# Altium schematic sheet SR.SchDoc
size A4; SheetNumber: 6; SheetTotal: 7
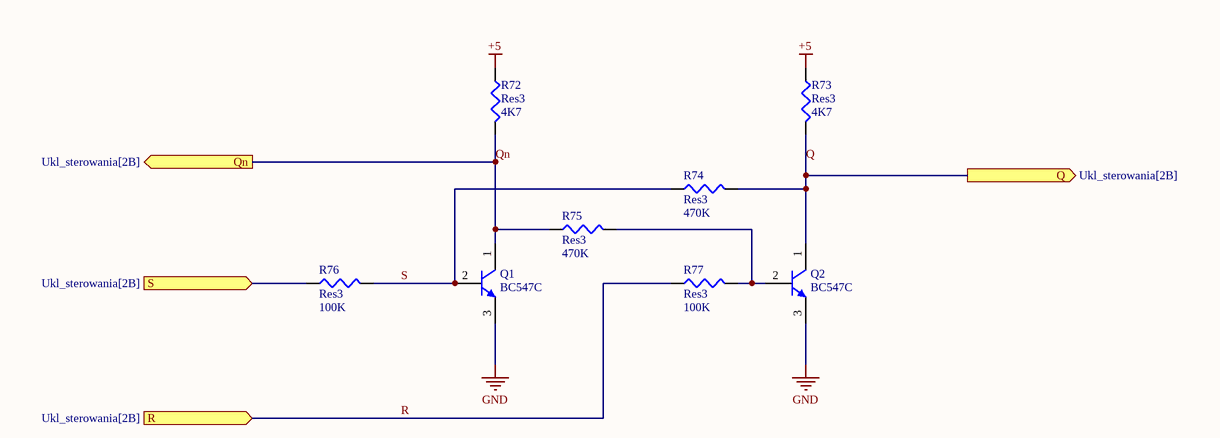
[diagram p0: SR.SchDoc]

## Parts
Q1  BC547C  [ONSC-TO-92-3-29-11]
Q2  BC547C  [ONSC-TO-92-3-29-11]
R72  Res3  value 4K7  [J1-0603]
R73  Res3  value 4K7  [J1-0603]
R74  Res3  value 470K  [J1-0603]
R75  Res3  value 470K  [J1-0603]
R76  Res3  value 100K  [J1-0603]
R77  Res3  value 100K  [J1-0603]

## Ports
Q (out, see Ukl_sterowania[2B]), Qn (out, see Ukl_sterowania[2B]), R (in, see Ukl_sterowania[2B]), S (in, see Ukl_sterowania[2B])

## Nets
+5: R72.1 R73.1
GND: Q1.3(E) Q2.3(E)
Q: Q2.1(C) R73.2 R74.2 ; port Q
Qn: Q1.1(C) R72.2 R75.1 ; port Qn
R: R77.1 ; port R
S: Q1.2(B) R74.1 R76.2
S: R76.1 ; port S  [a separate net that carries the same name]
NetQ2_2: Q2.2(B) R75.2 R77.2

## Library data of the parts
Q1 Q2 = CMP-1048-01437-1: Amplifier Transistor, NPN Silicon, 3-Pin TO-92, Bulk Box; Manufacturer: On Semiconductor; IC Continuous (A): 0.1; fT Min (MHz): 150; Mounting Technology: Through Hole; ComponentLink1URL: http://www.onsemi.com/; ComponentLink1Description: Manufacturer URL; ComponentLink3URL: http://www.onsemi.cn/pub_link/Collateral/2N6426-D.PDF; DatasheetVersion: Rev. 7; PackageVersion: Rev. AM; Packing: Bulk Box; RoHS: FALSE; Polarity: NPN; PartNumber: BC547C; ComponentLink2URL: http://www.onsemi.com/pub_link/Collateral/BC546-D.PDF; ComponentLink3Description: Package Specification; PackageDescription: 3-Pin Transistor Outline, Body 4.825 x 3.685 mm, Pitch 1.27 mm; PackageReference: TO-92-3-29-11_AM_SL; ComponentLink2Description: Datasheet
R72-R77 = Res3: Resistor; Published: 8-Jun-2000; LatestRevisionDate: 29-May-2009; LatestRevisionNote: IPC-7351 Footprint Added.; PackageReference: J1-0603; Publisher: Altium Limited; PackageDescription: Chip Resistor